# Altium schematic sheet Tetris_main.SchDoc
size A4; SheetNumber: 1; SheetTotal: 4
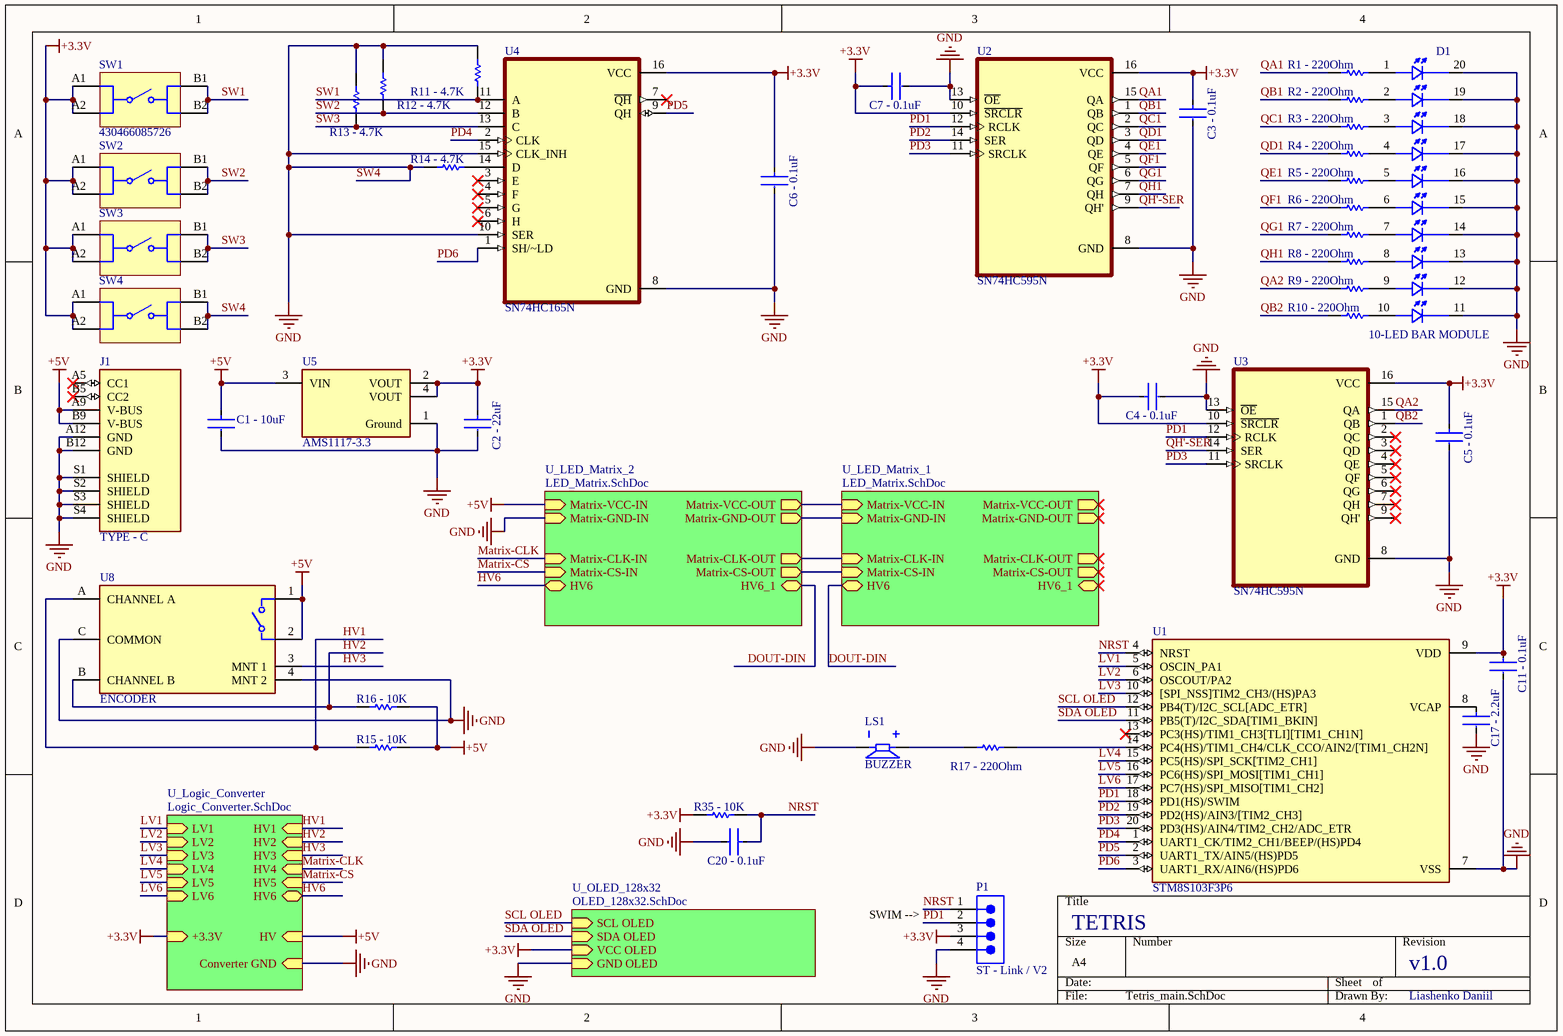
[diagram p0: Tetris_main.SchDoc]

## Parts
C1_-_10uF  GRM188R60J106ME47D  [FP-GRM188-0_1-e0_2_0_55-IPC_A]  (value not drawn)
C2_-_22uF  CC0603MRX5R5BB226  [FP-CC0603-DC-MFG]  (value not drawn)
C3_-_0.1uF  CC0603KRX7R7BB104  [FP-CC0603-DA-MFG]  (value not drawn)
C4_-_0.1uF  CC0603KRX7R7BB104  [FP-CC0603-DA-MFG]  (value not drawn)
C5_-_0.1uF  CC0603KRX7R7BB104  [FP-CC0603-DA-MFG]  (value not drawn)
C6_-_0.1uF  CC0603KRX7R7BB104  [FP-CC0603-DA-MFG]  (value not drawn)
C7_-_0.1uF  CC0603KRX7R7BB104  [FP-CC0603-DA-MFG]  (value not drawn)
C11_-_0.1uF  CC0603KRX7R7BB104  [FP-CC0603-DA-MFG]  (value not drawn)
C17_-_2.2uF  CC0805KKX7R7BB105  [FP-CC0805-0_85-MFG]  (value not drawn)
C20_-_0.1uF  CC0603KRX7R7BB104  [FP-CC0603-DA-MFG]  (value not drawn)
D1  10-LED BAR MODULE  [DIP750W50P254L2540H825Q20]
J1  TYPE - C  [CUI_UJC-HP-3-SMT-TR]
LS1  BUZZER  [XDCR_CPI-148-24-90T-67]
P1  ST - Link / V2  [61300411021]
R1_-_220Ohm  RC0402FR-13220RL  [RESC1005X40X25ML05T10]  (value not drawn)
R2_-_220Ohm  RC0402FR-13220RL  [RESC1005X40X25ML05T10]  (value not drawn)
R3_-_220Ohm  RC0402FR-13220RL  [RESC1005X40X25ML05T10]  (value not drawn)
R4_-_220Ohm  RC0402FR-13220RL  [RESC1005X40X25ML05T10]  (value not drawn)
R5_-_220Ohm  RC0402FR-13220RL  [RESC1005X40X25ML05T10]  (value not drawn)
R6_-_220Ohm  RC0402FR-13220RL  [RESC1005X40X25ML05T10]  (value not drawn)
R7_-_220Ohm  RC0402FR-13220RL  [RESC1005X40X25ML05T10]  (value not drawn)
R8_-_220Ohm  RC0402FR-13220RL  [RESC1005X40X25ML05T10]  (value not drawn)
R9_-_220Ohm  RC0402FR-13220RL  [RESC1005X40X25ML05T10]  (value not drawn)
R10_-_220Ohm  RC0402FR-13220RL  [RESC1005X40X25ML05T10]  (value not drawn)
R11_-_4.7K  RC0603JR-074K7L  [RESC1608X55X25ML10T15]  (value not drawn)
R12_-_4.7K  RC0603JR-074K7L  [RESC1608X55X25ML10T15]  (value not drawn)
R13_-_4.7K  RC0603JR-074K7L  [RESC1608X55X25ML10T15]  (value not drawn)
R14_-_4.7K  RC0603JR-074K7L  [RESC1608X55X25ML10T15]  (value not drawn)
R15_-_10K  RC0603JR-074K7L  [RESC1608X55X25ML10T15]  (value not drawn)
R16_-_10K  RC0603JR-074K7L  [RESC1608X55X25ML10T15]  (value not drawn)
R17_-_220Ohm  RC0402FR-13220RL  [RESC1005X40X25ML05T10]  (value not drawn)
R35_-_10K  RC0603JR-074K7L  [RESC1608X55X25ML10T15]  (value not drawn)
SW1  430466085726  [430466085726]
SW2  430466085726  [430466085726]  (value not drawn)
SW3  430466085726  [430466085726]  (value not drawn)
SW4  430466085726  [430466085726]  (value not drawn)
U1  STM8S103F3P6  [SOP65P640X120-20N]
U2  SN74HC595N  [DIP794W45P254L1969H508Q16]
U3  SN74HC595N  [DIP794W45P254L1969H508Q16]
U4  SN74HC165N  [DIP794W45P254L1969H508Q16]
U5  AMS1117-3.3  [FP-AMS1117-IPC_B]
U8  ENCODER  [FP-PEC11R-4115F-S0018-MFG]

## Sub-sheets
U_LED_Matrix_1 = LED_Matrix.SchDoc: Matrix-CLK-IN (in), Matrix-CS-IN (in), HV6 (bidir), HV6_1 (bidir), Matrix-GND-IN (in), Matrix-GND-OUT (out), Matrix-CLK-OUT (out), Matrix-CS-OUT (out), Matrix-VCC-IN (in), Matrix-VCC-OUT (out)
U_LED_Matrix_2 = LED_Matrix.SchDoc: Matrix-CLK-IN (in), Matrix-CS-IN (in), HV6 (bidir), HV6_1 (bidir), Matrix-GND-IN (in), Matrix-GND-OUT (out), Matrix-CLK-OUT (out), Matrix-CS-OUT (out), Matrix-VCC-IN (in), Matrix-VCC-OUT (out)
U_Logic_Converter = Logic_Converter.SchDoc: LV1 (in), HV1 (in), LV2 (in), HV2 (in), LV3 (in), HV3 (in), LV4 (in), HV4 (in), LV5 (in), HV5 (in), LV6 (in), HV6 (bidir), +3.3V (in), HV (in), Converter GND (in)
U_OLED_128x32 = OLED_128x32.SchDoc: SCL OLED (in), SDA OLED (in), VCC OLED (in), GND OLED (in)

## Nets
+3.3V: C2_-_22uF.1 C3_-_0.1uF.1 C4_-_0.1uF.1 C5_-_0.1uF.1 C6_-_0.1uF.1 C7_-_0.1uF.1 C11_-_0.1uF.1 P1.3 R35_-_10K.1 SW1.A1 SW1.A2 SW2.A1 SW2.A2 SW3.A1 SW3.A2 SW4.A1 SW4.A2 U1.9(VDD) U2.10(~{SRCLR}) U2.16(VCC) U3.10(~{SRCLR}) U3.16(VCC) U4.16(VCC) U5.2(VOUT) U5.4(VOUT) ; sheet U_Logic_Converter/+3.3V, sheet U_OLED_128x32/VCC OLED
+5V: C1_-_10uF.1 J1.A9(V-BUS) J1.B9(V-BUS) R15_-_10K.2 R16_-_10K.2 U5.3(VIN) U8.1 U8.2 ; sheet U_Logic_Converter/HV, sheet U_LED_Matrix_2/Matrix-VCC-IN
SW4: C1_-_10uF.2 C2_-_22uF.2 C3_-_0.1uF.2 C4_-_0.1uF.2 C5_-_0.1uF.2 C6_-_0.1uF.2 C7_-_0.1uF.2 C11_-_0.1uF.2 C17_-_2.2uF.2 C20_-_0.1uF.2 D1.11 D1.12 D1.13 D1.14 D1.15 D1.16 D1.17 D1.18 D1.19 D1.20 J1.A12(GND) J1.B12(GND) J1.S1(SHIELD) J1.S2(SHIELD) J1.S3(SHIELD) J1.S4(SHIELD) LS1.N P1.4 R11_-_4.7K.2 R12_-_4.7K.2 R13_-_4.7K.2 R14_-_4.7K.1 SW4.B1 SW4.B2 U1.7(VSS) U2.8(GND) U2.13(~{OE}) U3.8(GND) U3.13(~{OE}) U4.8(GND) U4.10(SER) U4.15(CLK_INH) U5.1(Ground) U8.4(MNT_2) U8.C(COMMON) ; sheet U_Logic_Converter/Converter GND, sheet U_OLED_128x32/GND OLED, sheet U_LED_Matrix_2/Matrix-GND-IN  [also labelled GND]
HV1: R15_-_10K.1 U8.A(CHANNEL_A) ; sheet U_Logic_Converter/HV1
HV2: R16_-_10K.1 U8.B(CHANNEL_B) ; sheet U_Logic_Converter/HV2
HV3: U8.3(MNT_1) ; sheet U_Logic_Converter/HV3
HV6: sheet U_Logic_Converter/HV6, sheet U_LED_Matrix_2/HV6
LV1: U1.5(OSCIN_PA1) ; sheet U_Logic_Converter/LV1
LV2: U1.6(OSCOUT/PA2) ; sheet U_Logic_Converter/LV2
LV3: U1.10([SPI_NSS]TIM2_CH3/(HS)PA3) ; sheet U_Logic_Converter/LV3
LV4: U1.15(PC5(HS)/SPI_SCK[TIM2_CH1]) ; sheet U_Logic_Converter/LV4
LV5: U1.16(PC6(HS)/SPI_MOSI[TIM1_CH1]) ; sheet U_Logic_Converter/LV5
LV6: U1.17(PC7(HS)/SPI_MISO[TIM1_CH2]) ; sheet U_Logic_Converter/LV6
Matrix-CLK: sheet U_Logic_Converter/HV4, sheet U_LED_Matrix_2/Matrix-CLK-IN
Matrix-CS: sheet U_Logic_Converter/HV5, sheet U_LED_Matrix_2/Matrix-CS-IN
NRST: C20_-_0.1uF.1 P1.1 R35_-_10K.2 U1.4(NRST)
PD1: P1.2 U1.18(PD1(HS)/SWIM) U2.12(RCLK) U3.12(RCLK)
PD2: U1.19(PD2(HS)/AIN3/[TIM2_CH3]) U2.14(SER)
PD3: U1.20(PD3(HS)/AIN4/TIM2_CH2/ADC_ETR) U2.11(SRCLK) U3.11(SRCLK)
PD4: U1.1(UART1_CK/TIM2_CH1/BEEP/(HS)PD4) U4.2(CLK)
PD5: U1.2(UART1_TX/AIN5/(HS)PD5) U4.9(QH)
PD6: U1.3(UART1_RX/AIN6/(HS)PD6) U4.1(SH/~LD)
QA1: R1_-_220Ohm.1 U2.15(QA)
QA2: R9_-_220Ohm.1 U3.15(QA)
QB1: R2_-_220Ohm.1 U2.1(QB)
QB2: R10_-_220Ohm.1 U3.1(QB)
QC1: R3_-_220Ohm.1 U2.2(QC)
QD1: R4_-_220Ohm.1 U2.3(QD)
QE1: R5_-_220Ohm.1 U2.4(QE)
QF1: R6_-_220Ohm.1 U2.5(QF)
QG1: R7_-_220Ohm.1 U2.6(QG)
QH1: R8_-_220Ohm.1 U2.7(QH)
QH'-SER: U2.9(QH') U3.14(SER)
SCL OLED: U1.12(PB4(T)/I2C_SCL[ADC_ETR]) ; sheet U_OLED_128x32/SCL OLED
SDA OLED: U1.11(PB5(T)/I2C_SDA[TIM1_BKIN]) ; sheet U_OLED_128x32/SDA OLED
SW1: R11_-_4.7K.1 SW1.B1 SW1.B2 U4.11(A)
SW2: R12_-_4.7K.1 SW2.B1 SW2.B2 U4.12(B)
SW3: R13_-_4.7K.1 SW3.B1 SW3.B2 U4.13(C)
NetC17_-_2.2uF_1: C17_-_2.2uF.1 U1.8(VCAP)
NetD1_1: D1.1 R1_-_220Ohm.2
NetD1_2: D1.2 R2_-_220Ohm.2
NetD1_3: D1.3 R3_-_220Ohm.2
NetD1_4: D1.4 R4_-_220Ohm.2
NetD1_5: D1.5 R5_-_220Ohm.2
NetD1_6: D1.6 R6_-_220Ohm.2
NetD1_7: D1.7 R7_-_220Ohm.2
NetD1_8: D1.8 R8_-_220Ohm.2
NetD1_9: D1.9 R9_-_220Ohm.2
NetD1_10: D1.10 R10_-_220Ohm.2
NetLS1_P: LS1.P R17_-_220Ohm.1
NetR14_-_4.7K_2: R14_-_4.7K.2 U4.14(D)
NetR17_-_220Ohm_2: R17_-_220Ohm.2 U1.14(PC4(HS)/TIM1_CH4/CLK_CCO/AIN2/[TIM1_CH2N])
(unnamed): sheet U_LED_Matrix_1/Matrix-CLK-IN, sheet U_LED_Matrix_2/Matrix-CLK-OUT
(unnamed): sheet U_LED_Matrix_1/Matrix-CS-IN, sheet U_LED_Matrix_2/Matrix-CS-OUT
(unnamed): sheet U_LED_Matrix_1/Matrix-GND-IN, sheet U_LED_Matrix_2/Matrix-GND-OUT
(unnamed): sheet U_LED_Matrix_1/Matrix-VCC-IN, sheet U_LED_Matrix_2/Matrix-VCC-OUT

Not connected (* = marked no-connect by the designer): J1 A5(CC1)* B5(CC2)*; U1 13(PC3(HS)/TIM1_CH3[TLI][TIM1_CH1N])*; U3 2(QC)* 3(QD)* 4(QE)* 5(QF)* 6(QG)* 7(QH)* 9(QH')*; U4 3(E)* 4(F)* 5(G)* 6(H)* 7(~{QH})*

## Notes on the sheet
- DOUT-DIN
- SWIM -->
- (near U1) TETRIS
- v1.0
- Liashenko Daniil

## Library data of the parts
C1_-_10uF = CMP-2006-02792-2: Chip Multilayer Ceramic Capacitors for General Purpose, 0603, 10uF, X5R, 15%, 20%, 6.3V; Packaging: Tape and Reel; Voltage Rating (DC): 6.3V; Width: 0.031inch; Termination: SMD/SMT; Dielectric: X5R; Package Quantity: 4000; Voltage Rating: 6.3V; Capacitance: 10uF; Case/Package: 0603; Min Operating Temperature: -55°C; Voltage: 6.3V; Length: 1.6mm; Thickness: 0.035inch; Lead Free: Lead Free; Depth: 0.8mm; Case Code (Imperial): 0603; Max Operating Temperature: 85°C; Material: Ceramic; Height: 0.8mm; Tolerance: 20%; Mount: Surface Mount; REACH SVHC: No SVHC; Radiation Hardening: No; Case Code (Metric): 1608
C2_-_22uF = CMP-2000-06075-2: CAP CER 22UF 6.3V X5R 0603; Tolerance: 20%; Termination: SMD/SMT; Mount: Surface Mount; Depth: 0.8mm; Thickness: 0.035inch; Packaging: Tape and Reel; RoHS Compliant: Yes; Case/Package: 0603; Min Operating Temperature: -55°C; Package Quantity: 4000; Weight: 7.1E-05oz; Max Operating Temperature: 85°C; Voltage Rating (DC): 6.3V; Halogen Free: Halogen Free; Lead Free: Lead Free; Resistor Type: Ceramic; Case Code (Imperial): 0603; Width: 0.031inch; Case Code (Metric): 1608; Voltage Rating: 6.3V; Length: 0.063inch; Capacitance: 22uF; Dielectric: X5R
C3_-_0.1uF C4_-_0.1uF C5_-_0.1uF C6_-_0.1uF C7_-_0.1uF C11_-_0.1uF C20_-_0.1uF = CMP-2000-05002-2: CAP CER 0.1UF 16V X7R 0603; Manufacturer: YAGEO; Tolerance: 0.1; Value: 100 nF; Temperature Coefficient: 15%; Material: Ceramic; Voltage Rating: 16 V; Package: CC0603-DA; ComponentLink2Description: Datasheet; Octopart: https://octopart.com/cc0603krx7r7bb104-yageo-192941; Temperature Range High: +125°C; Digikey Description: CAP CER 0.1UF 16V X7R 0603; Voltage: 16 V; Device Class L2: Capacitors; Height: 0.9mm; Temperature: -55°C to +125°C; Manufacturer Part Number: CC0603KRX7R7BB104; Device Class L1: Passive Components; Device Class L3: Ceramic Capacitors; ComponentLink2URL: http://www.yageo.com/documents/recent/UPY-GPHC_X7R_6.3V-to-50V_18.pdf; Footprint Url: http://www.yageo.com/exep/pages/download/literatures/UPY-C_GEN_24.pdf; RoHS: TRUE; Temperature Range Low: -55°C; Temperature Characteristic: X7R; Lead Free: Yes; Capacitance: 100 nF; Category: Cap; Mouser Description: Multilayer Ceramic Capacitor, CC Series, 0.1 - F, - 10%, X7R, 16 V, 0603 [1608 Metric]; Automotive: No
C17_-_2.2uF = CMP-03422-000001-1: CAP CER 1UF 16V X7R 0805; Manufacturer: Yageo; Material: Ceramic; Tolerance: 0.1; Voltage Rating: 16 V; Category: Cap; Capacitance: 1 uF; ComponentLink2Description: Datasheet; Automotive: No; Temperature Range High: +85°C; RoHS: TRUE; Footprint Url: http://www.yageo.com/exep/pages/download/literatures/UPY-C_GEN_24.pdf; Mouser Description: Multilayer Ceramic Capacitors MLCC - SMD/SMT 1.0uF 16V X7R 10%; Height: 0.95mm; Ipc Land Pattern Name: CAPC200125X85; Temperature: -30°C to +85°C; Lead Free: Yes; Value: 1 uF; Temperature Characteristic: X7R; Package: CC0805-0.85; Temperature Range Low: -30°C; Device Class L1: Passive Components; Device Class L3: Ceramic Capacitors; Octopart: https://octopart.com/cc0805kkx7r7bb105-yageo-8376555; Manufacturer Part Number: CC0805KKX7R7BB105; ComponentLink2URL: http://www.yageo.com/documents/recent/UPY-GPHC_Y5V_6.3V-to-50V_8.pdf; Device Class L2: Capacitors; Digikey Description: CAP CER 1UF 16V X7R 0805
D1 = CMP-004-00031-1: LED Circuit Board Indicator Bar - 10 Wide, DIP Red (x 10) Diffused, White 2V 30mA Through Hole; MF: Kingbright; Check_prices: https://www.snapeda.com/parts/DC10EWA/Kingbright/view-part/268697/?ref=eda; Pins: 20; Component Type: Standard; Design Item ID: DC10EWA; Purchase-URL: https://pricing.snapeda.com/search/part/DC10EWA/?ref=eda; Availability: In Stock; MP: DC10EWA; Source: DC10EWA.SchLib; Value: *; Price: None; Case/Package: DIP-20 Kingbright; SnapEDA_Link: https://www.snapeda.com/parts/DC10EWA/Kingbright/view-part/268697/?ref=snap
J1 = CMP-039-000000-1: Source: UJC-HP-3-SMT-TR.SchLib; Package: None; Design Item ID: UJC-HP-3-SMT-TR; Component Type: Standard; Value: *; Availability: Unavailable; Pin Count: 10; MP: UJC-HP-3-SMT-TR; Price: None
LS1 = CMP-037-000000-1: 13,9 РјРј, 24 Р’ РїРѕСЃС‚. С‚РѕРєР°, 90 РґР‘, СЃРєРІРѕР·РЅРѕРµ РѕС‚РІРµСЂСЃС‚РёРµ, РїСЊРµР·РѕСЌР»РµРєС‚СЂРёС‡РµСЃРєРёР№ Р·РІСѓРєРѕРІРѕР№ РёРЅРґРёРєР°С‚РѕСЂ; MF: Same Sky; MP: CPI-148-24-90T-67; Source: CPI-148-24-90T-67.SchLib; SnapEDA_Link: https://www.snapeda.com/parts/CPI-148-24-90T-67/Same+Sky/view-part/?ref=snap; Value: *; Check_prices: https://www.snapeda.com/parts/CPI-148-24-90T-67/Same+Sky/view-part/?ref=eda; Package: None; Design Item ID: CPI-148-24-90T-67; Pin Count: 2; Component Type: Standard
P1 = CMP-043-000000-1: NexarPartId: 31153320; Gender: Male; Number of Positions: 4; Current Rating: 3A; Pitch: 2.54mm; Contact Resistance: 20m?; Connector Type: Male Pin; Operating Supply Voltage: 250V; Contact Mating Length: 5.9944mm; Number of Rows: 1; Contact Plating: Gold; Design Item ID: CMP-1502-01063-3; Lead Pitch: 2.54mm; Component Type: Standard; Number of Pins: 4; Number of Contacts: 4; Mount: Through Hole; REACH SVHC: Unknown; Source: Components - 25.08.25 - 11.48.SchLib; Contact Material: Copper; Pin Count: 4; Termination: Solder; RoHS: Compliant; Color: Black
R1_-_220Ohm R2_-_220Ohm R3_-_220Ohm R4_-_220Ohm R5_-_220Ohm R6_-_220Ohm R7_-_220Ohm R8_-_220Ohm R9_-_220Ohm R10_-_220Ohm R17_-_220Ohm = CMP-2002-07866-1: Manufacturer: Yageo; Part Number: RC0402FR-13220RL
R11_-_4.7K R12_-_4.7K R13_-_4.7K R14_-_4.7K R15_-_10K R16_-_10K R35_-_10K = CMP-2000-05024-1: Chip Resistor, 4.7 KOhm, +/- 5%, 100 mW, -55 to 155 degC, 0603 (1608 Metric), RoHS, Tape and Reel; Manufacturer: Yageo; Resistance: 4.7kOhms; Temperature Coefficient: 100PPM/C; Power Rating: 100mW; Voltage Rating: 50V; Operating Temperature Range: -55Cto+155C; Case Code - mm: 1608; Tolerance: 5%; Product: ThickFilmResistorsGeneralPurpose; Case Code - in: 0603; Datasheet URL: http://www.yageo.com/documents/recent/PYu-RC_Group_51_RoHS_L_04.pdf; Package Reference: 603; Datasheet Version: Rev. 4, 02/2016; Package Description: 2-Pin Surface Mount Device, Body 1.6 x 0.8 mm; Manufacturer URL: http://www.yageo.com/; Series: RC; Packaging: Reel; Termination Style: SMD/SMT
SW1-SW4 = CMP-1456-00006-3: Switch Tactile Spst-no 0.05A 12V; Insulation Resistance: 100MΩ; Contact Current Rating: 50mA; Min Operating Temperature: -40°C; Height: 8.5mm; Contact Plating: Silver; RoHS: Compliant; Color: White; Packaging: Bulk; Voltage Rating: 12V; Max Operating Temperature: 85°C; Current Rating: 50mA
U1 = CMP-031-00026-1: STM8 series Microcontroller IC 8-Bit 16MHz 8KB (8K x 8) FLASH 20-TSSOP; MF: STMicroelectronics; MP: STM8S103F3P6; Case/Package: TSSOP-20 STMicroelectronics; Check_prices: https://www.snapeda.com/parts/STM8S103F3P6/STMicroelectronics/view-part/?ref=eda; Pins: 20; SnapEDA_Link: https://www.snapeda.com/parts/STM8S103F3P6/STMicroelectronics/view-part/?ref=snap; Component Type: Standard; Design Item ID: STM8S103F3P6; Value: *; Source: STM8S103F3P6.SchLib
U2 U3 = CMP-029-000000-1: 8-bit shift registers with 3-state output registers; MF: Texas Instruments; Source: SN74HC595N.SchLib; Design Item ID: SN74HC595N; Value: *; Package: PDIP-16 Texas Instruments; Check_prices: https://www.snapeda.com/parts/SN74HC595N/Texas+Instruments/view-part/?ref=eda; Component Type: Standard; MP: SN74HC595N; SnapEDA_Link: https://www.snapeda.com/parts/SN74HC595N/Texas+Instruments/view-part/?ref=snap; Pin Count: 16
U4 = CMP-031-000000-4: 8-Bit Parallel-Load Shift Registers; MF: Texas Instruments; Value: *; SnapEDA_Link: https://www.snapeda.com/parts/SN74HC165N/Texas+Instruments/view-part/?ref=snap; Source: SN74HC165N.SchLib; MP: SN74HC165N; Check_prices: https://www.snapeda.com/parts/SN74HC165N/Texas+Instruments/view-part/?ref=eda; Pin Count: 16; Package: PDIP-16 Texas Instruments; Component Type: Standard; Design Item ID: SN74HC165N
U5 = CMP-012-00000-1: Fixed Positive LDO Regulator, 3.3V, 1.3V Dropout, PDSO3; Package Body Material: Plastic; Channels: 1; Regulator Type: FIXED POSITIVE SINGLE OUTPUT LDO REGULATOR; Output Voltage1-Max: 3.399V; Output Current1-Max: 1A; Output Voltage1-Min: 3.201V; Height - Seated (Max): 1.8mm; Reach SVHC Compliant: Yes; Terminal Pitch: 2.29mm; Operating Temperature, TJ-Min: -40°C; Package Shape: Rectangular; RoHS Compliant: Yes; Case/Package: SOP; JESD-30 Code: R-PDSO-G3; Pins: 3; Dropout Voltage1-Max: 1.3V; Terminal Position: DUAL; Surface Mount: Yes; Package Style: SMALL OUTLINEMeter; Operating Temperature, TJ-Max: 125°C; Width: 3.505mm; Output Voltage1-Nom: 3.3V; Terminal Form: Gull Wing; Length: 6.505mm
U8 = CMP-07421-000064-1: ROTARY ENCODER MECHANICAL 18PPR; Hole Diameter: 1.8mm; Output Type: Quadrature; Number of Channels: 2; Detent: Yes; Pulses per Revolution: 18; Height: 13.4mm; Min Operating Temperature: -30°C; Radiation Hardening: No; Series: PEC11R; Max Operating Temperature: 70°C; Package Quantity: 150; Built in Switch: Yes; Mount: Through Hole; Packaging: Bulk; Termination: PC Pins; Number of Pins: 5; REACH SVHC: No SVHC; Width: 12.5mm; Encoder Type: Mechanical; Length: 21.5mm; RoHS Compliant: Yes; Orientation: Vertical